# EAGLE schematic ZeeSoC_v1.0 (EAGLE 6.5.0)

## Sheet 1 of 2
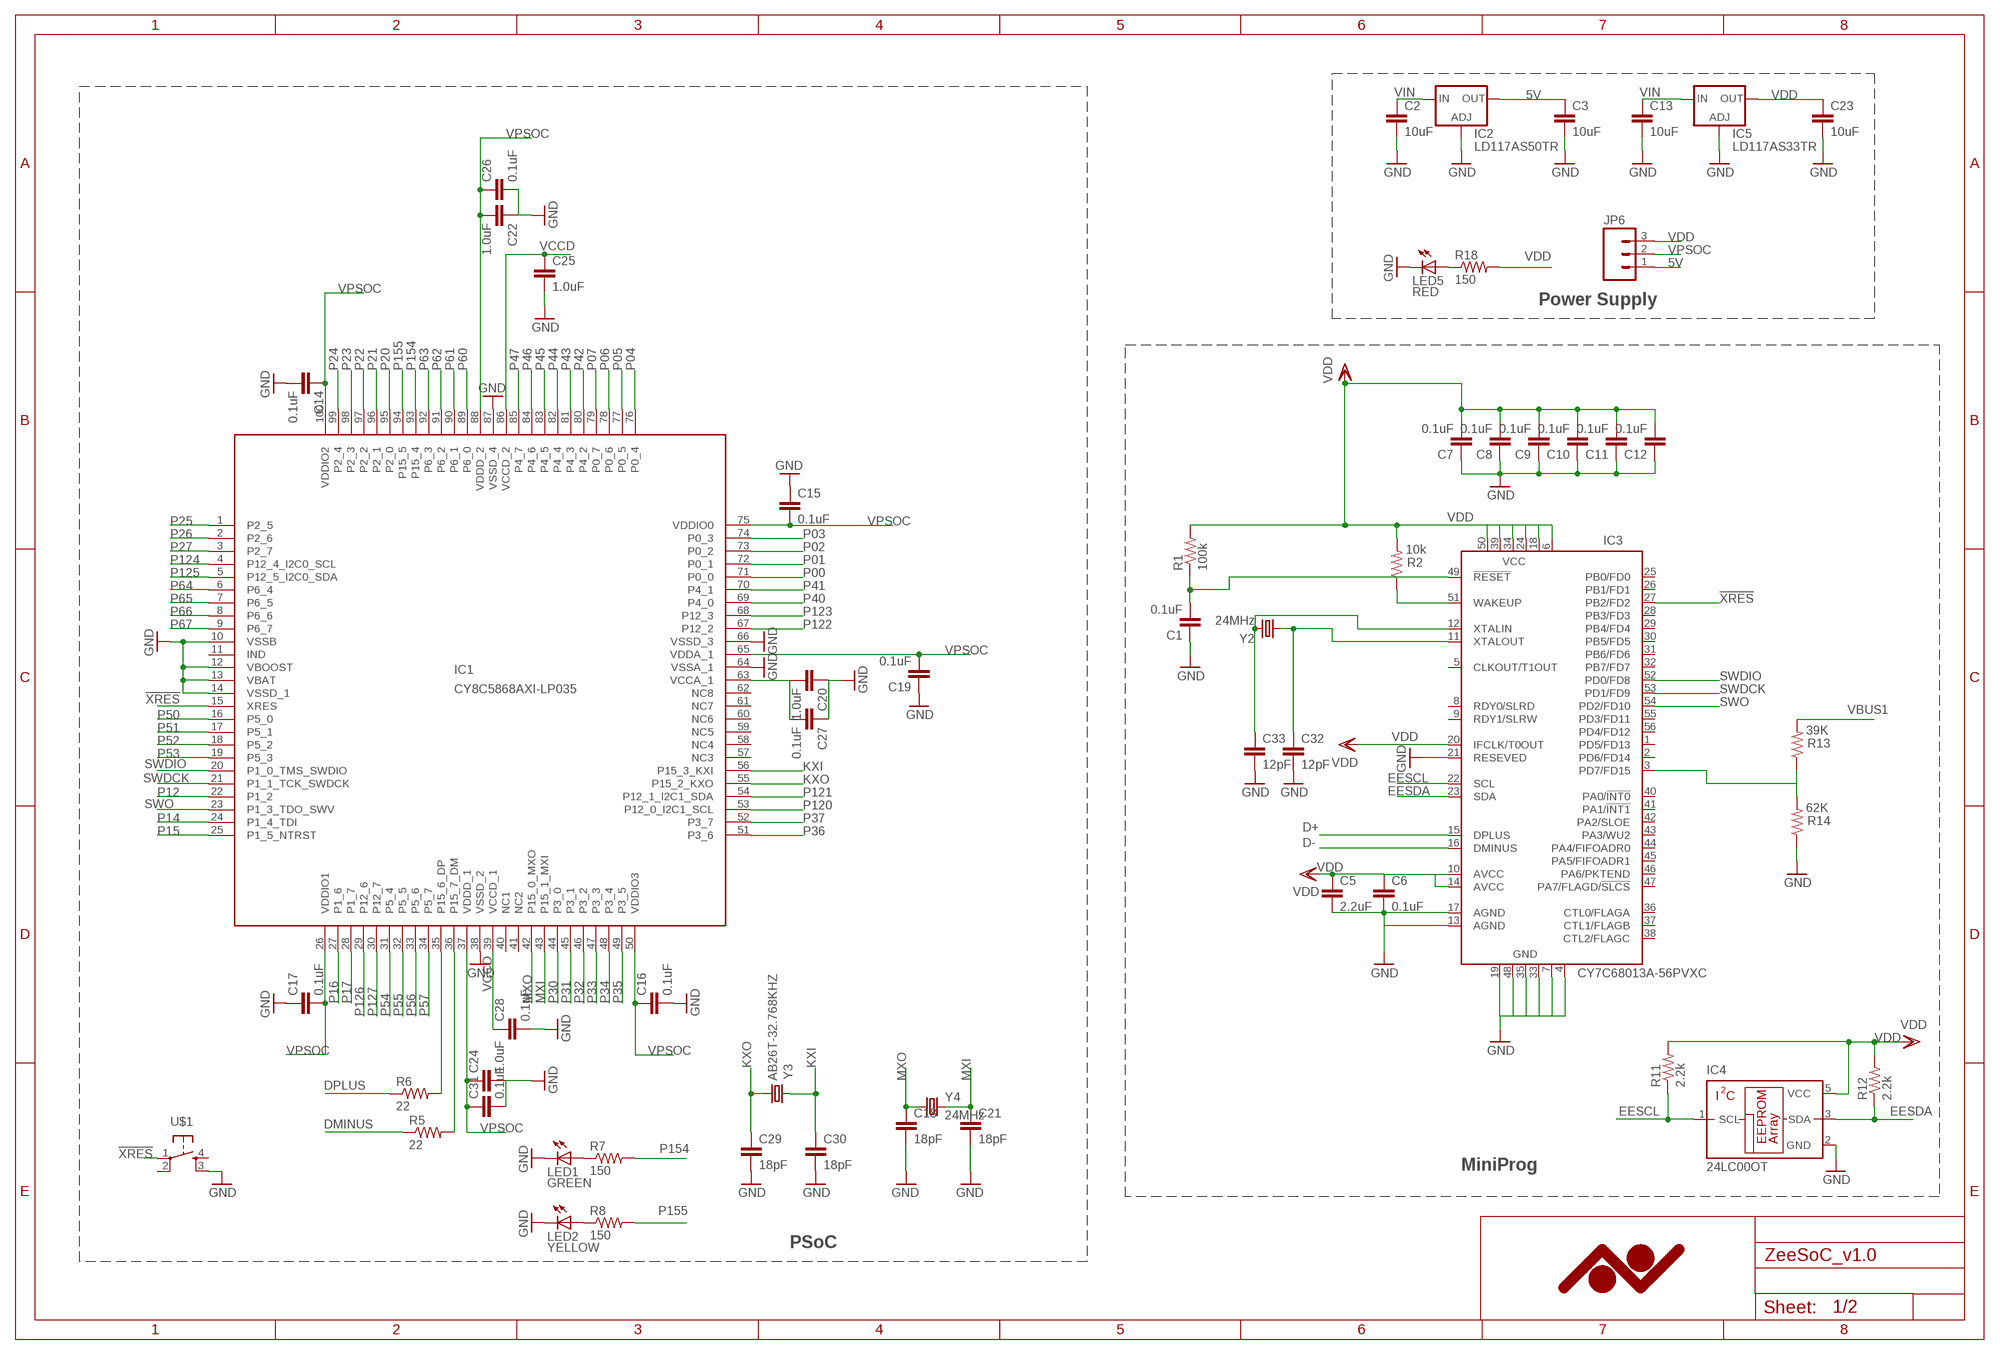
[diagram p0: schematic, sheet 1]

### Parts
C1  0.1uF  CAP0603-CAP  [0603-CAP]
C2  10uF  CAP0805  [0805]
C3  10uF  CAP0805  [0805]
C5  2.2uF  CAP0805  [0805]
C6  0.1uF  CAP0603-CAP  [0603-CAP]
C7  0.1uF  CAP0603-CAP  [0603-CAP]
C8  0.1uF  CAP0603-CAP  [0603-CAP]
C9  0.1uF  CAP0603-CAP  [0603-CAP]
C10  0.1uF  CAP0603-CAP  [0603-CAP]
C11  0.1uF  CAP0603-CAP  [0603-CAP]
C12  0.1uF  CAP0603-CAP  [0603-CAP]
C13  10uF  CAP0805  [0805]
C14  0.1uF  CAP0603-CAP  [0603-CAP]
C15  0.1uF  CAP0603-CAP  [0603-CAP]
C16  0.1uF  CAP0603-CAP  [0603-CAP]
C17  0.1uF  CAP0603-CAP  [0603-CAP]
C18  18pF  CAP0603-CAP  [0603-CAP]
C19  0.1uF  CAP0603-CAP  [0603-CAP]
C20  1.0uF  CAP0603-CAP  [0603-CAP]
C21  18pF  CAP0603-CAP  [0603-CAP]
C22  1.0uF  CAP0603-CAP  [0603-CAP]
C23  10uF  CAP0805  [0805]
C24  1.0uF  CAP0603-CAP  [0603-CAP]
C25  1.0uF  CAP0603-CAP  [0603-CAP]
C26  0.1uF  CAP0603-CAP  [0603-CAP]
C27  0.1uF  CAP0603-CAP  [0603-CAP]
C28  0.1uF  CAP0603-CAP  [0603-CAP]
C29  18pF  CAP0603-CAP  [0603-CAP]
C30  18pF  CAP0603-CAP  [0603-CAP]
C31  0.1uF  CAP0603-CAP  [0603-CAP]
C32  12pF  CAP0603-CAP  [0603-CAP]
C33  12pF  CAP0603-CAP  [0603-CAP]
IC1  CY8C5868AXI-LP035  CY8C3X66AXI  [TQFP-100]
IC2  LD117AS50TR  [SOT223]
IC3  CY7C68013A-56PVXC  [SSOP56]
IC4  24LC00OT  [SOT23-5L]
IC5  LD117AS33TR  [SOT223]
JP6  M03PTH  [1X03]
LED1  GREEN  LED0603  [LED-0603]
LED2  YELLOW  LED0603  [LED-0603]
LED5  RED  LED0603  [LED-0603]
R1  100k  RESISTOR0603  [0603-RES]
R2  10k  RESISTOR0603  [0603-RES]
R5  22  RESISTOR0603  [0603-RES]
R6  22  RESISTOR0603  [0603-RES]
R7  150  RESISTOR0603-RES  [0603-RES]
R8  150  RESISTOR0603-RES  [0603-RES]
R11  2.2k  RESISTOR0603  [0603-RES]
R12  2.2k  RESISTOR0603  [0603-RES]
R13  39K  RESISTOR0603  [0603-RES]
R14  62K  RESISTOR0603  [0603-RES]
R18  150  RESISTOR0603-RES  [0603-RES]
U$1  SWITCH_6.8X6.2  [SWITCH_6.8X6.2]
Y2  24MHz  CRYSTALHC49US  [HC49US]
Y3  AB26T-32.768KHZ  CRYSTAL32-SMD  [CRYSTAL-32KHZ-SMD]
Y4  24MHz  CRYSTALHC49US  [HC49US]

### Nets
5V: C3.1 IC2.4(OUT) JP6.1 ; also sheet 2
!XRES: IC1.15(XRES) IC3.27(PB2/FD2) U$1.1 ; also sheet 2
D+: IC3.15(DPLUS) ; also sheet 2
D-: IC3.16(DMINUS) ; also sheet 2
DMINUS: R5.1 ; also sheet 2
DPLUS: R6.1 ; also sheet 2
EESCL: IC3.22(SCL) IC4.1(SCL) R11.1
EESDA: IC3.23(SDA) IC4.3(SDA) R12.1
GND: C1.1 C2.2 C3.2 C5.2 C6.2 C7.1 C8.1 C9.1 C10.1 C11.1 C12.1 C13.2 C14.2 C15.1 C16.2 C17.1 C18.2 C19.1 C20.1 C21.2 C22.1 C23.2 C24.2 C25.2 C26.2 C27.1 C28.2 C29.2 C30.2 C31.2 C32.2 C33.2 IC1.10(VSSB) IC1.12(VBOOST) IC1.13(VBAT) IC1.14(VSSD_1) IC1.38(VSSD_2) IC1.64(VSSA_1) IC1.66(VSSD_3) IC1.87(VSSD_4) IC2.1(ADJ) IC3.4(GND) IC3.7(GND) IC3.13(AGND) IC3.17(AGND) IC3.19(GND) IC3.21(RESEVED) IC3.33(GND) IC3.35(GND) IC3.48(GND) IC4.2(GND) IC5.1(ADJ) LED1.C LED2.C LED5.C R14.1 U$1.3 ; also sheet 2
KXI: C30.1 IC1.56(P15_3_KXI) Y3.X1
KXO: C29.1 IC1.55(P15_2_KXO) Y3.X2
MXI: C21.1 IC1.43(P15_1_MXI) Y4.2
MXO: C18.1 IC1.42(P15_0_MXO) Y4.1
N$1: C1.2 IC3.49(!RESET) R1.1
N$5: IC3.51(WAKEUP) R2.1
N$7: C20.2 C27.2 IC1.63(VCCA_1)
N$8: IC1.35(P15_6_DP) R6.2
N$9: IC1.36(P15_7_DM) R5.2
N$11: LED1.A R7.1
N$12: LED2.A R8.1
N$15: IC3.3(PD7/FD15) R13.1 R14.2
N$18: LED5.A R18.1
P00: IC1.71(P0_0) ; also sheet 2
P01: IC1.72(P0_1) ; also sheet 2
P02: IC1.73(P0_2) ; also sheet 2
P03: IC1.74(P0_3) ; also sheet 2
P04: IC1.76(P0_4) ; also sheet 2
P05: IC1.77(P0_5) ; also sheet 2
P06: IC1.78(P0_6) ; also sheet 2
P07: IC1.79(P0_7) ; also sheet 2
P12: IC1.22(P1_2) ; also sheet 2
P14: IC1.24(P1_4_TDI) ; also sheet 2
P15: IC1.25(P1_5_NTRST) ; also sheet 2
P16: IC1.27(P1_6) ; also sheet 2
P17: IC1.28(P1_7) ; also sheet 2
P20: IC1.95(P2_0) ; also sheet 2
P21: IC1.96(P2_1) ; also sheet 2
P22: IC1.97(P2_2) ; also sheet 2
P23: IC1.98(P2_3) ; also sheet 2
P24: IC1.99(P2_4) ; also sheet 2
P25: IC1.1(P2_5) ; also sheet 2
P26: IC1.2(P2_6) ; also sheet 2
P27: IC1.3(P2_7) ; also sheet 2
P30: IC1.44(P3_0) ; also sheet 2
P31: IC1.45(P3_1) ; also sheet 2
P32: IC1.46(P3_2) ; also sheet 2
P33: IC1.47(P3_3) ; also sheet 2
P34: IC1.48(P3_4) ; also sheet 2
P35: IC1.49(P3_5) ; also sheet 2
P36: IC1.51(P3_6) ; also sheet 2
P37: IC1.52(P3_7) ; also sheet 2
P40: IC1.69(P4_0) ; also sheet 2
P41: IC1.70(P4_1) ; also sheet 2
P42: IC1.80(P4_2) ; also sheet 2
P43: IC1.81(P4_3) ; also sheet 2
P44: IC1.82(P4_4) ; also sheet 2
P45: IC1.83(P4_5) ; also sheet 2
P46: IC1.84(P4_6) ; also sheet 2
P47: IC1.85(P4_7) ; also sheet 2
P50: IC1.16(P5_0) ; also sheet 2
P51: IC1.17(P5_1) ; also sheet 2
P52: IC1.18(P5_2) ; also sheet 2
P53: IC1.19(P5_3) ; also sheet 2
P54: IC1.31(P5_4) ; also sheet 2
P55: IC1.32(P5_5) ; also sheet 2
P56: IC1.33(P5_6) ; also sheet 2
P57: IC1.34(P5_7) ; also sheet 2
P60: IC1.89(P6_0) ; also sheet 2
P61: IC1.90(P6_1) ; also sheet 2
P62: IC1.91(P6_2) ; also sheet 2
P63: IC1.92(P6_3) ; also sheet 2
P64: IC1.6(P6_4) ; also sheet 2
P65: IC1.7(P6_5) ; also sheet 2
P66: IC1.8(P6_6) ; also sheet 2
P67: IC1.9(P6_7) ; also sheet 2
P120: IC1.53(P12_0_I2C1_SCL) ; also sheet 2
P121: IC1.54(P12_1_I2C1_SDA) ; also sheet 2
P122: IC1.67(P12_2) ; also sheet 2
P123: IC1.68(P12_3) ; also sheet 2
P124: IC1.4(P12_4_I2C0_SCL) ; also sheet 2
P125: IC1.5(P12_5_I2C0_SDA) ; also sheet 2
P126: IC1.29(P12_6) ; also sheet 2
P127: IC1.30(P12_7) ; also sheet 2
P154: IC1.93(P15_4) R7.2
P155: IC1.94(P15_5) R8.2
SWDCK: IC1.21(P1_1_TCK_SWDCK) IC3.53(PD1/FD9)
SWDIO: IC1.20(P1_0_TMS_SWDIO) IC3.52(PD0/FD8)
SWO: IC1.23(P1_3_TDO_SWV) IC3.54(PD2/FD10)
VBUS1: R13.2 ; also sheet 2
VCCD: C25.1 C28.1 IC1.39(VCCD_1) IC1.86(VCCD_2)
VDD: C5.1 C6.1 C7.2 C8.2 C9.2 C10.2 C11.2 C12.2 C23.1 IC3.6(VCC) IC3.10(AVCC) IC3.14(AVCC) IC3.18(VCC) IC3.20(IFCLK/T0OUT) IC3.24(VCC) IC3.34(VCC) IC3.39(VCC) IC3.50(VCC) IC4.5(VCC) IC5.4(OUT) JP6.3 R1.2 R2.2 R11.2 R12.2 R18.2 ; also sheet 2
VIN: C2.1 C13.1 IC2.3(IN) IC5.3(IN) ; also sheet 2
VPSOC: C14.1 C15.2 C16.1 C17.2 C19.2 C22.2 C24.1 C26.1 C31.1 IC1.26(VDDIO1) IC1.37(VDDD_1) IC1.50(VDDIO3) IC1.65(VDDA_1) IC1.75(VDDIO0) IC1.88(VDDD_2) IC1.100(VDDIO2) JP6.2 ; also sheet 2
XIN: C33.1 IC3.12(XTALIN) Y2.2
XOUT: C32.1 IC3.11(XTALOUT) Y2.1
Unconnected: IC1.11(IND) IC1.40(NC1) IC1.41(NC2) IC1.57(NC3) IC1.58(NC4) IC1.59(NC5) IC1.60(NC6) IC1.61(NC7) IC1.62(NC8) IC3.1(PD5/FD13) IC3.2(PD6/FD14) IC3.5(CLKOUT/T1OUT) IC3.8(RDY0/SLRD) IC3.9(RDY1/SLRW) IC3.25(PB0/FD0) IC3.26(PB1/FD1) IC3.28(PB3/FD3) IC3.29(PB4/FD4) IC3.30(PB5/FD5) IC3.31(PB6/FD6) IC3.32(PB7/FD7) IC3.36(CTL0/FLAGA) IC3.37(CTL1/FLAGB) IC3.38(CTL2/FLAGC) IC3.40(PA0/!INT0) IC3.41(PA1/!INT1) IC3.42(PA2/SLOE) IC3.43(PA3/WU2) IC3.44(PA4/FIFOADR0) IC3.45(PA5/FIFOADR1) IC3.46(PA6/PKTEND) IC3.47(PA7/FLAGD/!SLCS) IC3.55(PD3/FD11) IC3.56(PD4/FD12) U$1.2 U$1.4

### Notes on the sheet
- Power Supply
- MiniProg
- PSoC
- D:/My_dream/Avnette/COMPANY_LOGO_NAME/Logo_v3_MONO_TOP.bmp
- D:/My_dream/Avnette/COMPANY_LOGO_NAME/Logo_v3_MONO_TOP.bmp

## Sheet 2 of 2
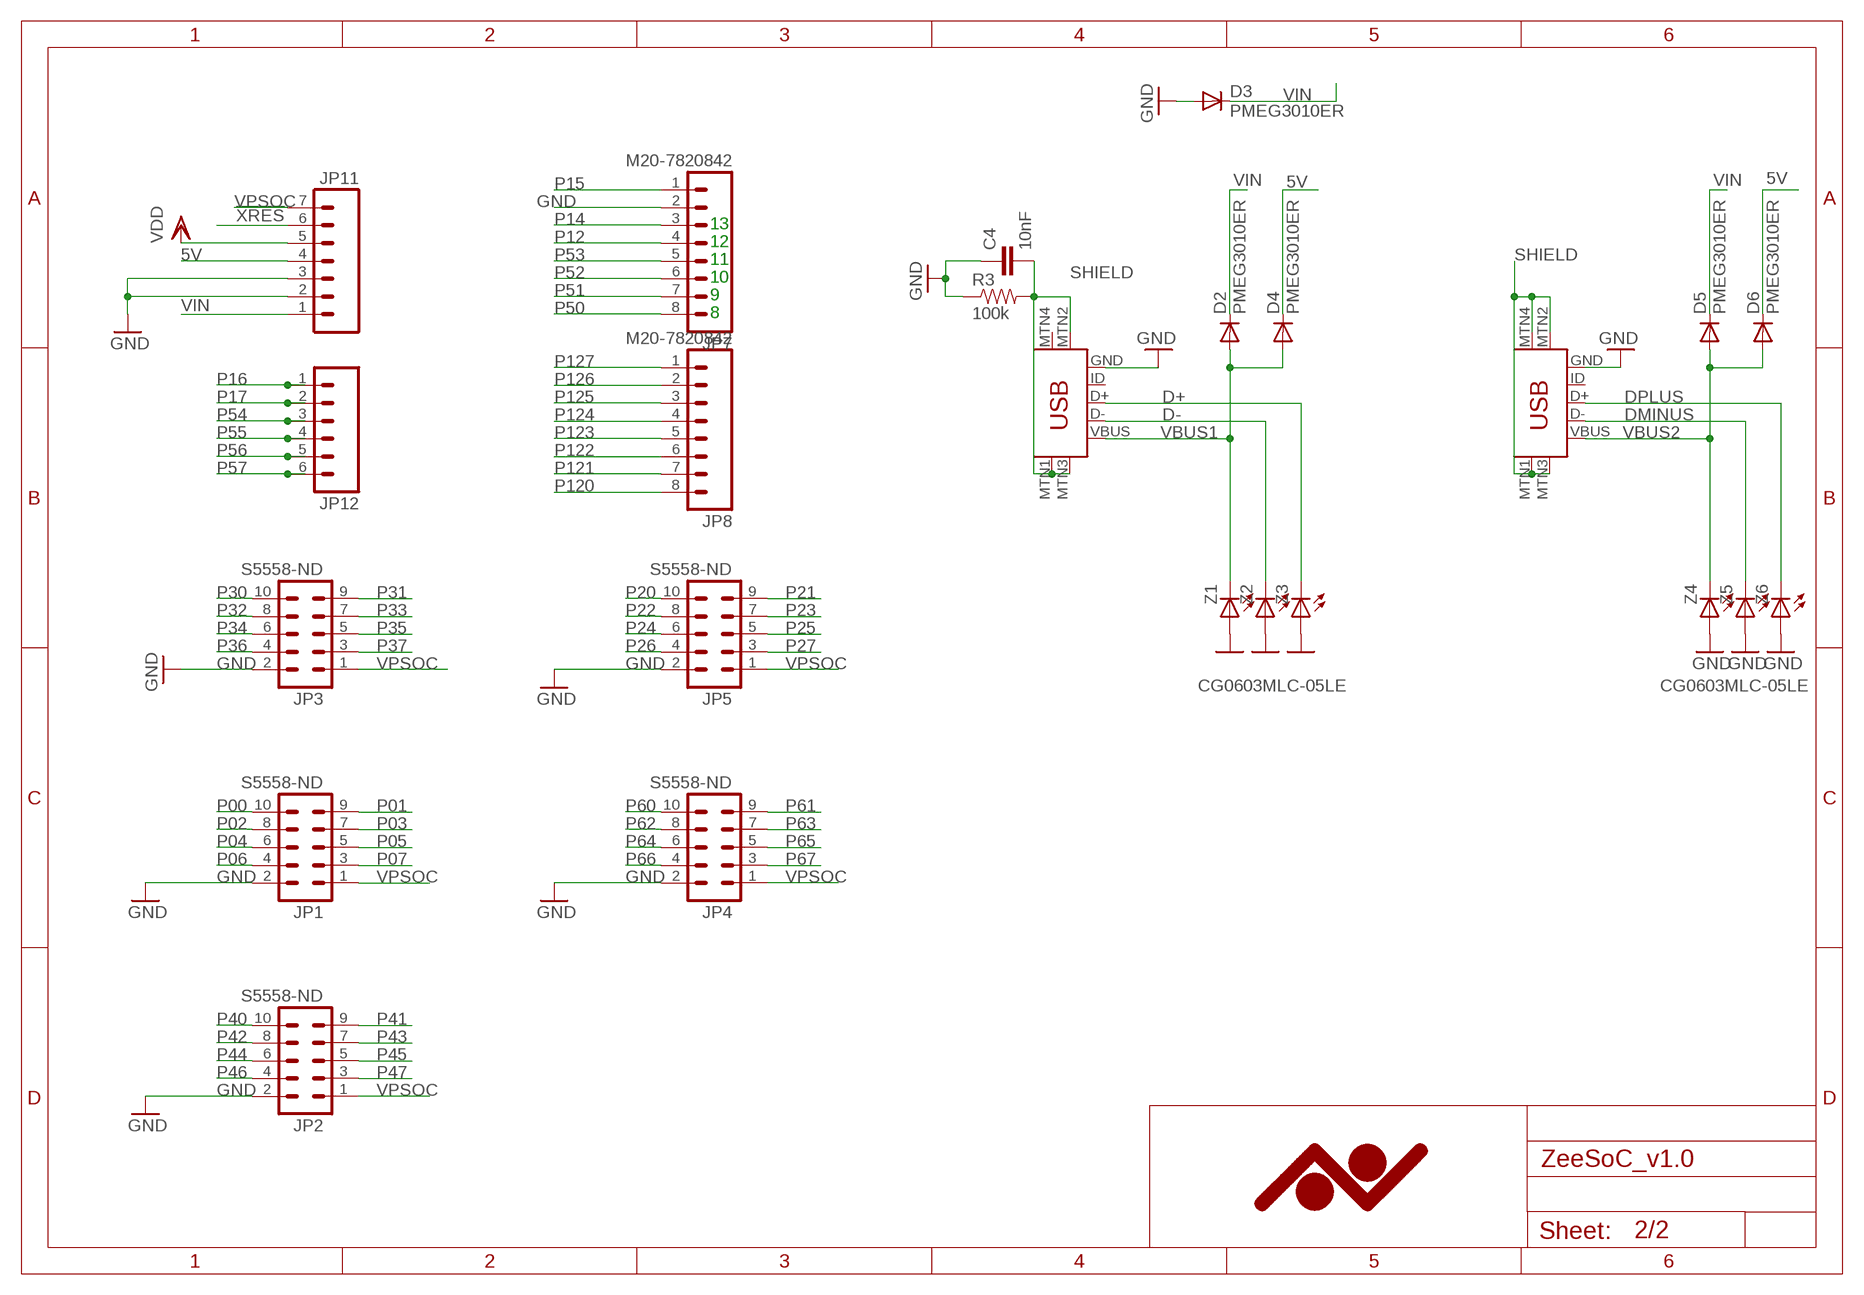
[diagram p1: schematic, sheet 2]

### Parts
C4  10nF  CAP0603-CAP  [0603-CAP]
D2  PMEG3010ER  DIODE-SOD123  [SOD123]
D3  PMEG3010ER  DIODE-SOD123  [SOD123]
D4  PMEG3010ER  DIODE-SOD123  [SOD123]
D5  PMEG3010ER  DIODE-SOD123  [SOD123]
D6  PMEG3010ER  DIODE-SOD123  [SOD123]
JP1  S5558-ND  M05X2BLANK  [2X5-NS]
JP2  S5558-ND  M05X2BLANK  [2X5-NS]
JP3  S5558-ND  M05X2BLANK  [2X5-NS]
JP4  S5558-ND  M05X2BLANK  [2X5-NS]
JP5  S5558-ND  M05X2BLANK  [2X5-NS]
JP7  M20-7820842  M081X08  [1X08]
JP8  M20-7820842  M081X08  [1X08]
JP11  M07  [1X07]
JP12  M06SIP  [1X06]
R3  100k  RESISTOR0603  [0603-RES]
U$5  USB-MINIB-5PIN  [USB-MINIB]
U$6  USB-MINIB-5PIN  [USB-MINIB]
Z1  CG0603MLC-05LE  LED0603  [LED-0603]
Z2  CG0603MLC-05LE  LED0603  [LED-0603]
Z3  CG0603MLC-05LE  LED0603  [LED-0603]
Z4  CG0603MLC-05LE  LED0603  [LED-0603]
Z5  CG0603MLC-05LE  LED0603  [LED-0603]
Z6  CG0603MLC-05LE  LED0603  [LED-0603]

### Nets
5V: D4.C D6.C JP11.4 ; also sheet 1
!XRES: JP11.6 ; also sheet 1
D+: U$5.D+ Z3.C ; also sheet 1
D-: U$5.D- Z2.C ; also sheet 1
DMINUS: U$6.D- Z5.C ; also sheet 1
DPLUS: U$6.D+ Z6.C ; also sheet 1
GND: C4.1 D3.A JP1.2 JP2.2 JP3.2 JP4.2 JP5.2 JP7.2 JP11.2 JP11.3 R3.1 U$5.GND U$6.GND Z1.A Z2.A Z3.A Z4.A Z5.A Z6.A ; also sheet 1
P00: JP1.10 ; also sheet 1
P01: JP1.9 ; also sheet 1
P02: JP1.8 ; also sheet 1
P03: JP1.7 ; also sheet 1
P04: JP1.6 ; also sheet 1
P05: JP1.5 ; also sheet 1
P06: JP1.4 ; also sheet 1
P07: JP1.3 ; also sheet 1
P12: JP7.4 ; also sheet 1
P14: JP7.3 ; also sheet 1
P15: JP7.1 ; also sheet 1
P16: JP12.1 ; also sheet 1
P17: JP12.2 ; also sheet 1
P20: JP5.10 ; also sheet 1
P21: JP5.9 ; also sheet 1
P22: JP5.8 ; also sheet 1
P23: JP5.7 ; also sheet 1
P24: JP5.6 ; also sheet 1
P25: JP5.5 ; also sheet 1
P26: JP5.4 ; also sheet 1
P27: JP5.3 ; also sheet 1
P30: JP3.10 ; also sheet 1
P31: JP3.9 ; also sheet 1
P32: JP3.8 ; also sheet 1
P33: JP3.7 ; also sheet 1
P34: JP3.6 ; also sheet 1
P35: JP3.5 ; also sheet 1
P36: JP3.4 ; also sheet 1
P37: JP3.3 ; also sheet 1
P40: JP2.10 ; also sheet 1
P41: JP2.9 ; also sheet 1
P42: JP2.8 ; also sheet 1
P43: JP2.7 ; also sheet 1
P44: JP2.6 ; also sheet 1
P45: JP2.5 ; also sheet 1
P46: JP2.4 ; also sheet 1
P47: JP2.3 ; also sheet 1
P50: JP7.8 ; also sheet 1
P51: JP7.7 ; also sheet 1
P52: JP7.6 ; also sheet 1
P53: JP7.5 ; also sheet 1
P54: JP12.3 ; also sheet 1
P55: JP12.4 ; also sheet 1
P56: JP12.5 ; also sheet 1
P57: JP12.6 ; also sheet 1
P60: JP4.10 ; also sheet 1
P61: JP4.9 ; also sheet 1
P62: JP4.8 ; also sheet 1
P63: JP4.7 ; also sheet 1
P64: JP4.6 ; also sheet 1
P65: JP4.5 ; also sheet 1
P66: JP4.4 ; also sheet 1
P67: JP4.3 ; also sheet 1
P120: JP8.8 ; also sheet 1
P121: JP8.7 ; also sheet 1
P122: JP8.6 ; also sheet 1
P123: JP8.5 ; also sheet 1
P124: JP8.4 ; also sheet 1
P125: JP8.3 ; also sheet 1
P126: JP8.2 ; also sheet 1
P127: JP8.1 ; also sheet 1
SHIELD: C4.2 R3.2 U$5.MTN1(MTN2) U$5.MTN2(MTN3) U$5.MTN3(MTN1) U$6.MTN1(MTN2) U$6.MTN2(MTN3) U$6.MTN3(MTN1) U$6.MTN4
VBUS1: D2.A D4.A U$5.VBUS Z1.C ; also sheet 1
VBUS2: D5.A D6.A U$6.VBUS Z4.C
VDD: JP11.5 ; also sheet 1
VIN: D2.C D3.C D5.C JP11.1 ; also sheet 1
VPSOC: JP1.1 JP2.1 JP3.1 JP4.1 JP5.1 JP11.7 ; also sheet 1
Unconnected: U$5.ID U$5.MTN4 U$6.ID

### Notes on the sheet
- 13
- 12
- 11
- 10
- 9
- 8

## Library data of the parts
C1 C6-C12 C14-C17 C28 C31 = SparkFun-Capacitors:CAP: Capacitor Standard 0603 ceramic capacitor, and 0.1" leaded capacitor.; PN: LMK105BJ104KV-F
C2 C3 C13 C23 = SparkFun:CAP: Capacitor Standard 0603 ceramic capacitor, and 0.1" leaded capacitor.; PN: C0805C106K4PACTU
C4 = SparkFun-Capacitors:CAP: Capacitor Standard 0603 ceramic capacitor, and 0.1" leaded capacitor.; PN: TMK105B7103KV-F
C5 = SparkFun-Capacitors:CAP: Capacitor Standard 0603 ceramic capacitor, and 0.1" leaded capacitor.; PN: CC0603KRX5R5BB225
C18 C21 C29 C30 = SparkFun-Capacitors:CAP: Capacitor Standard 0603 ceramic capacitor, and 0.1" leaded capacitor.; PN: GRM1555C1H180FZ01D
C19 C20 C22 C24-C27 = SparkFun-Capacitors:CAP: Capacitor Standard 0603 ceramic capacitor, and 0.1" leaded capacitor.; PN: JMK105BJ105KV-F
C32 C33 = SparkFun-Capacitors:CAP: Capacitor Standard 0603 ceramic capacitor, and 0.1" leaded capacitor.; PN: GRM1555C1H120FZ01D
D2-D6 = diode:DIODE-: DIODE; PN: PMEG3010ER
IC1 = PSoC3:CY8C3X66AXI: CY8C_pins edit this description Auto generated by make-symbol-device-package-bsdl.ulp Rev. 34 Source: CY8C_pins.txt; PN: CY8C5568AXI-060
IC2 IC5 = v-reg:LD117A?*: Low drop fixed and adjustable positive voltage regulators 1 A Source: http://www.st.com/stonline/products/literature/ds/7194/ld1117axx.pdf
IC3 = cypress:CY7C6801*A-56: EZ-USB FX2LP (TM) USB Microcontroller Source: http://www.cypress.com .. cy7c68013a_5.pdf; MF: CYPRESS SEMICONDUCTOR CORPORAT; MPN: CY7C68013A-56PVXC; OC_FARNELL: 1269134; OC_NEWARK: 19M7114
IC4 = microchip:24*00: Serial EEPROM 128 bit, I2C (AA = 1.8 V/LC = 2.5 V/C = 5.0 V); PN: 24LC00T
JP1-JP5 = SparkFun:M05X2: Header 5x2 Standard 10-pin dual row 0.1" header. Commonly used with AVR-ISP. Use with Spark Fun Electronics SKU: PRT-00778
JP6 = SparkFun-Connectors:M03: Header 3 Standard 3-pin 0.1" header. Use with straight break away headers (SKU : PRT-00116), right angle break away headers (PRT-00553), swiss pins (PRT-00743), machine pins (PRT-00117), and female headers (PRT-00115). Molex polarized connector foot print use with SKU : PRT-08232 with associated crimp pins and housings.
JP7 JP8 = SparkFun:M08: Header 8 Standard 8-pin 0.1" header. Use with straight break away headers (SKU : PRT-00116), right angle break away headers (PRT-00553), swiss pins (PRT-00743), machine pins (PRT-00117), and female headers (PRT-00115).
JP11 = SparkFun:M07: Header 7 Standard 7-pin 0.1" header. Use with straight break away headers (SKU : PRT-00116), right angle break away headers (PRT-00553), swiss pins (PRT-00743), machine pins (PRT-00117), and female headers (PRT-00115). NOTES ON THE VARIANTS LOCK and LOCK_LONGPADS... This footprint was designed to help hold the alignment of a through-hole component (i.e. 7-pin header) while soldering it into place. You may notice that each hole has been shifted either up or down by 0.005 of an inch from it's more standard position (which is usually a perfectly straight line). This slight alteration caused the pins (the squares in the middle) to touch the edges of the holes. Because they are alternating, it causes a "brace" to hold the header in place. 0.005 has proven to be the perfect amount of "off-center" position when using our standard breakaway headers. Although looks a little odd when you look at the bare footprint, once you have a header in there, the alteration is very hard to notice. Also, if you push a header all the way into place, it is covered up entirely on the bottom side. This idea of altering the position of holes to aid alignment will be further integrated into the Sparkfun Library for other footprints. It can help hold any component with 3 or more connection pins.
JP12 = SparkFun:M06: Header 6 Standard 6-pin 0.1" header. Use with straight break away headers (SKU : PRT-00116), right angle break away headers (PRT-00553), swiss pins (PRT-00743), machine pins (PRT-00117), and female headers (PRT-00115). Molex polarized connector foot print use with SKU : PRT-08094 with associated crimp pins and housings. NOTES ON THE VARIANTS LOCK and LOCK_LONGPADS... This footprint was designed to help hold the alignment of a through-hole component (i.e. 6-pin header) while soldering it into place. You may notice that each hole has been shifted either up or down by 0.005 of an inch from it's more standard position (which is a perfectly straight line). This slight alteration caused the pins (the squares in the middle) to touch the edges of the holes. Because they are alternating, it causes a "brace" to hold the component in place. 0.005 has proven to be the perfect amount of "off-center" position when using our standard breakaway headers. Although looks a little odd when you look at the bare footprint, once you have a header in there, the alteration is very hard to notice. Also, if you push a header all the way into place, it is covered up entirely on the bottom side. This idea of altering the position of holes to aid alignment will be further integrated into the Sparkfun Library for other footprints. It can help hold any component with 3 or more connection pins.
LED1 LED2 LED5 = SparkFun:LED: LEDs Standard schematic elements and footprints for 5mm, 3mm, 1206, and 0603 sized LEDs. 5mm - Spark Fun Electronics SKU : COM-00529 (and others); PN: VLMW1300-GS08
R1 R3 = SparkFun-Resistors:RESISTOR: Resistor Basic schematic elements and footprints for 0603, 1206, and PTH resistors.; PN: RR0510P-104-D
R2 = SparkFun-Resistors:RESISTOR: Resistor Basic schematic elements and footprints for 0603, 1206, and PTH resistors.; PN: ERJ-2GEJ103X
R5 R6 = SparkFun-Resistors:RESISTOR: Resistor Basic schematic elements and footprints for 0603, 1206, and PTH resistors.; PN: ERA-6AHD220V
R7 R8 R18 = SparkFun:RESISTOR: Resistor Basic schematic elements and footprints for 0603, 1206, and PTH resistors.; PN: CRCW0603150RFKEA
R11 R12 = SparkFun-Resistors:RESISTOR: Resistor Basic schematic elements and footprints for 0603, 1206, and PTH resistors.; PN: ERJ-2RKF2201X
R13 R14 = SparkFun-Resistors:RESISTOR: Resistor Basic schematic elements and footprints for 0603, 1206, and PTH resistors.
U$1 = Frenoy_Custom:SWITCH_6.8X6.2
U$5 U$6 = SparkFun:USB-MINIB: Mini-USB "B" connector with 5th pin broken out. Created new symbol breaking out 5th "ID" pin in mini/micro USB connector spec. See: http://en.wikipedia.org/wiki/Mini_usb#Cables. Uses same footprint as 4-pin symbol. Also added pins to connect to mounting / shield pads if required (probably not generally needed as signals aren't shielded once they leave the connector).; PN: 10033526-N3212LF
Y2 Y4 = SparkFun:CRYSTAL: Crystals Various standard crystals. Proven footprints. Spark Fun Electronics SKU : COM-00534; PN: ATS240C
Y3 = SparkFun:CRYSTAL: Crystals Various standard crystals. Proven footprints. Spark Fun Electronics SKU : COM-00534; PN: AB26T-32.768KHZ
Z1-Z6 = SparkFun:LED: LEDs Standard schematic elements and footprints for 5mm, 3mm, 1206, and 0603 sized LEDs. 5mm - Spark Fun Electronics SKU : COM-00529 (and others); PN: CG0603MLC-05LE

## Net classes
4 aref: width 0.254 mm, drill 0.61 mm, clearance 0.254 mm